# Altium schematic sheet sensors.SchDoc
size 381 x 355 mm; SheetNumber: 2; SheetTotal: 4
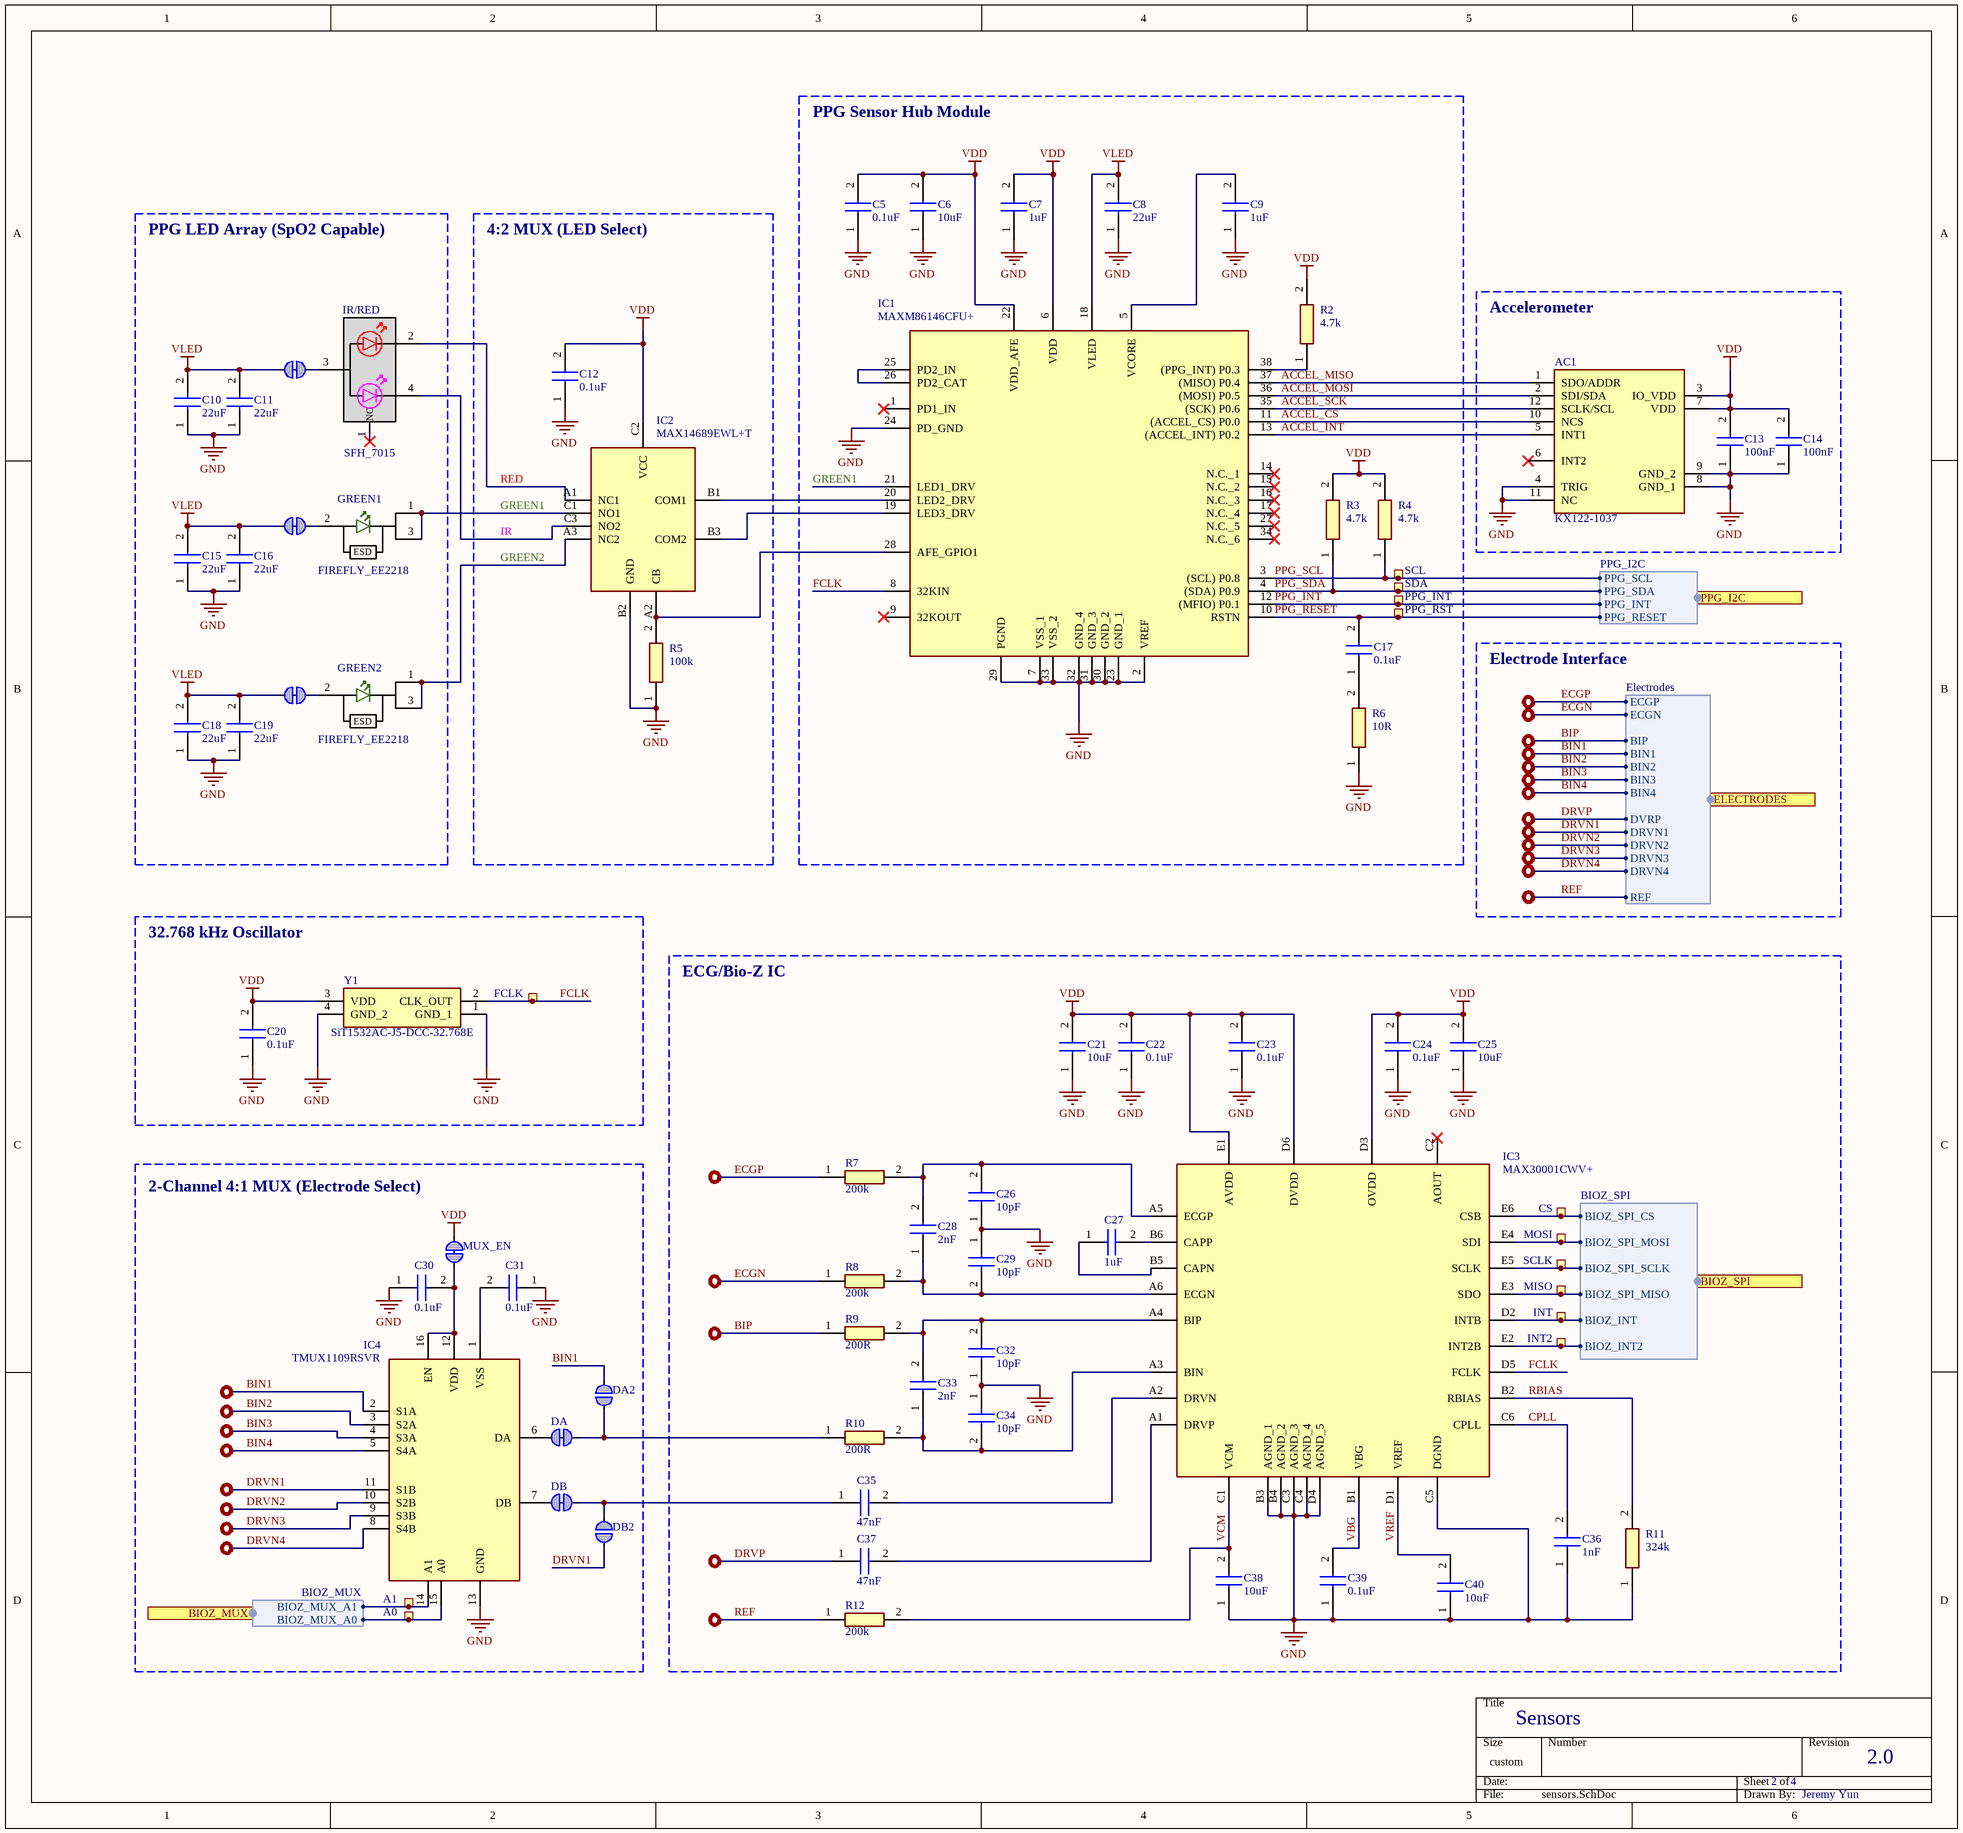
[diagram p0: sensors.SchDoc]

## Parts
A0  Ø1.0mm,SMD  [TP_SMD_D1.0mm]  (value not drawn)  (no BOM)
A1  Ø1.0mm,SMD  [TP_SMD_D1.0mm]  (value not drawn)  (no BOM)
AC1  KX122-1037  [KX1221037]
C5  0.1uF  [CAPC1005X55N]
C6  10uF  [CAPC1005X55N]
C7  1uF  [CAPC1005X55N]
C8  22uF  [CAPC1005X55N]
C9  1uF  [CAPC1005X55N]
C10  22uF  [CAPC1005X55N]
C11  22uF  [CAPC1005X55N]
C12  0.1uF  [CAPC1005X55N]
C13  100nF  [CAPC1005X55N]
C14  100nF  [CAPC1005X55N]
C15  22uF  [CAPC1005X55N]
C16  22uF  [CAPC1005X55N]
C17  0.1uF  [CAPC1005X55N]
C18  22uF  [CAPC1005X55N]
C19  22uF  [CAPC1005X55N]
C20  0.1uF  [CAPC1005X55N]
C21  10uF  [CAPC1005X55N]
C22  0.1uF  [CAPC1005X55N]
C23  0.1uF  [CAPC1005X55N]
C24  0.1uF  [CAPC1005X55N]
C25  10uF  [CAPC1005X55N]
C26  10pF  [CAPC0603X33N]
C27  1uF  [CAPC1005X55N]
C28  2nF  [C0603]
C29  10pF  [CAPC0603X33N]
C30  0.1uF  [CAPC1005X55N]
C31  0.1uF  [CAPC1005X55N]
C32  10pF  [CAPC0603X33N]
C33  2nF  [C0603]
C34  10pF  [CAPC0603X33N]
C35  47nF  [CAPC2012X140N]
C36  1nF  [C0402]
C37  47nF  [CAPC2012X140N]
C38  10uF  [CAPC1005X55N]
C39  0.1uF  [CAPC1005X55N]
C40  10uF  [CAPC1005X55N]
CS  Ø1.0mm,SMD  [TP_SMD_D1.0mm]  (value not drawn)  (no BOM)
DA  Solderbridge  [Solderbridge_Shorted]  (value not drawn)  (net tie, no BOM)
DA2  Solderbridge  [Solderbridge]  (value not drawn)  (no BOM)
DB  Solderbridge  [Solderbridge_Shorted]  (value not drawn)  (net tie, no BOM)
DB2  Solderbridge  [Solderbridge]  (value not drawn)  (no BOM)
FCLK  Ø1.0mm,SMD  [TP_SMD_D1.0mm]  (value not drawn)  (no BOM)
GR1  Solderbridge  [Solderbridge_Shorted]  (value not drawn)  (net tie, no BOM)
GR2  Solderbridge  [Solderbridge_Shorted]  (value not drawn)  (net tie, no BOM)
GREEN1  FIREFLY_EE2218  [CTDBLP31126C5D56J6U620R18]
GREEN2  FIREFLY_EE2218  [CTDBLP31126C5D56J6U620R18]
IC1  MAXM86146CFU+  [MAXM86146CFU]
IC2  MAX14689EWL+T  [BGA9C40P3X3_124X124X69]
IC3  MAX30001CWV+  [BGA30C50P6X5_293X274X69]
IC4  TMUX1109RSVR  [TMUX1109RSVR]
INT  Ø1.0mm,SMD  [TP_SMD_D1.0mm]  (value not drawn)  (no BOM)
INT2  Ø1.0mm,SMD  [TP_SMD_D1.0mm]  (value not drawn)  (no BOM)
IR/RED  SFH_7015  [SFH7015]
MISO  Ø1.0mm,SMD  [TP_SMD_D1.0mm]  (value not drawn)  (no BOM)
MOSI  Ø1.0mm,SMD  [TP_SMD_D1.0mm]  (value not drawn)  (no BOM)
MUX_EN  Solderbridge  [Solderbridge_Shorted]  (value not drawn)  (net tie, no BOM)
PPG_INT  Ø1.0mm,SMD  [TP_SMD_D1.0mm]  (value not drawn)  (no BOM)
PPG_RST  Ø1.0mm,SMD  [TP_SMD_D1.0mm]  (value not drawn)  (no BOM)
R2  4.7k  [RESC1005X40N]
R3  4.7k  [RESC1005X40N]
R4  4.7k  [RESC1005X40N]
R5  100k  [RESC1005X40N]
R6  10R  [RESC1005X40N]
R7  200k  [ERJ2RKD1004X]
R8  200k  [ERJ2RKD1004X]
R9  200R  [ERJ2RKD1004X]
R10  200R  [ERJ2RKD1004X]
R11  324k  [RESC1608X55N]
R12  200k  [ERJ2RKD1004X]
RED/IR  Solderbridge  [Solderbridge_Shorted]  (value not drawn)  (net tie, no BOM)
SCL  Ø1.0mm,SMD  [TP_SMD_D1.0mm]  (value not drawn)  (no BOM)
SCLK  Ø1.0mm,SMD  [TP_SMD_D1.0mm]  (value not drawn)  (no BOM)
SDA  Ø1.0mm,SMD  [TP_SMD_D1.0mm]  (value not drawn)  (no BOM)
Y1  SiT1532AC-J5-DCC-32.768E  [SiT1532ACJ5DCC32768E]

## Blocks framed on the sheet
PPG Sensor Hub Module: C5-C9 C17 IC1 PPG_INT PPG_RST R2-R4 R6 SCL SDA
PPG LED Array (SpO2 Capable): C10 C11 C15 C16 C18 C19 GR1 GR2 GREEN1 GREEN2 IR/RED RED/IR
4:2 MUX (LED Select): C12 IC2 R5
Accelerometer: AC1 C13 C14
32.768 kHz Oscillator: C20 FCLK Y1
ECG/Bio-Z IC: C21-C29 C32-C40 CS IC3 INT INT2 MISO MOSI R7-R12 SCLK
2-Channel 4:1 MUX (Electrode Select): A0 A1 C30 C31 DA DA2 DB DB2 IC4 MUX_EN

## Ports
BIOZ_MUX (harness BIOZ_MUX), BIOZ_SPI (harness BIOZ_SPI), ELECTRODES (harness Electrodes), PPG_I2C (harness PPG_I2C)

## Harnesses
Electrodes: ECGP, ECGN, BIN1, BIP, BIN2, BIN3, BIN4, DVRP, DRVN1, DRVN3, DRVN2, DRVN4, REF
BIOZ_SPI: BIOZ_SPI_CS, BIOZ_SPI_MOSI, BIOZ_SPI_MISO, BIOZ_SPI_SCLK, BIOZ_INT, BIOZ_INT2
PPG_I2C: PPG_SCL, PPG_SDA, PPG_INT, PPG_RESET
BIOZ_MUX: BIOZ_MUX_A0, BIOZ_MUX_A1

## Nets
GND: AC1.4(TRIG) AC1.8(GND_1) AC1.9(GND_2) AC1.11(NC) C5.1 C6.1 C7.1 C8.1 C9.1 C10.1 C11.1 C12.1 C13.1 C14.1 C15.1 C16.1 C18.1 C19.1 C20.1 C21.1 C22.1 C23.1 C24.1 C25.1 C26.1 C29.1 C30.1 C31.1 C32.1 C34.1 C36.1 C38.1 C39.1 C40.1 IC1.2(VREF) IC1.7(VSS_1) IC1.23(GND_1) IC1.24(PD_GND) IC1.29(PGND) IC1.30(GND_2) IC1.31(GND_3) IC1.32(GND_4) IC1.33(VSS_2) IC2.B2(GND) IC3.B3(AGND_1) IC3.B4(AGND_2) IC3.C3(AGND_3) IC3.C4(AGND_4) IC3.C5(DGND) IC3.D4(AGND_5) IC4.13(GND) R5.1 R6.1 R11.1 Y1.1(GND_1) Y1.4(GND_2)
VDD: AC1.3(IO_VDD) AC1.7(VDD) C5.2 C6.2 C7.2 C12.2 C13.2 C14.2 C20.2 C21.2 C22.2 C23.2 C24.2 C25.2 IC1.6(VDD) IC1.22(VDD_AFE) IC2.C2(VCC) IC3.D3(OVDD) IC3.D6(DVDD) IC3.E1(AVDD) MUX_EN.1 R2.2 R3.2 R4.2 Y1.3(VDD)
VLED: C8.2 C10.2 C11.2 C15.2 C16.2 C18.2 C19.2 GR1.1 GR2.1 IC1.18(VLED) RED/IR.1
ACCEL_CS: AC1.10(NCS) IC1.11((ACCEL_CS)_P0.0)
ACCEL_INT: AC1.5(INT1) IC1.13((ACCEL_INT)_P0.2)
ACCEL_MISO: AC1.1(SDO/ADDR) IC1.37((MISO)_P0.4)
ACCEL_MOSI: AC1.2(SDI/SDA) IC1.36((MOSI)_P0.5)
ACCEL_SCK: AC1.12(SCLK/SCL) IC1.35((SCK)_P0.6)
BIN1: DA2.1 IC4.2(S1A) ; port ELECTRODES.BIN1
BIN2: IC4.3(S2A) ; port ELECTRODES.BIN2
BIN3: IC4.4(S3A) ; port ELECTRODES.BIN3
BIN4: IC4.5(S4A) ; port ELECTRODES.BIN4
BIP: R9.1 ; port ELECTRODES.BIP
CPLL: C36.2 IC3.C6(CPLL)
DRVN1: DB2.2 IC4.11(S1B) ; port ELECTRODES.DRVN1
DRVN2: IC4.10(S2B) ; port ELECTRODES.DRVN2
DRVN3: IC4.9(S3B) ; port ELECTRODES.DRVN3
DRVN4: IC4.8(S4B) ; port ELECTRODES.DRVN4
DRVP: C37.1 ; port ELECTRODES.DVRP
ECGN: R8.1 ; port ELECTRODES.ECGN
ECGP: R7.1 ; port ELECTRODES.ECGP
FCLK: FCLK.1 IC1.8(32KIN) IC3.D5(FCLK) Y1.2(CLK_OUT)
GREEN1: GREEN1.1(K_1) GREEN1.3(K_2) IC1.21(LED1_DRV) IC2.C1(NO1)
GREEN2: GREEN2.1(K_1) GREEN2.3(K_2) IC2.A3(NC2)
IR: IC2.C3(NO2) IR/RED.4(CATHODE_EMITTER_2_(940_NM))
PPG_INT: IC1.12((MFIO)_P0.1) PPG_INT.1 ; port PPG_I2C.PPG_INT
PPG_RESET: C17.2 IC1.10(RSTN) PPG_RST.1 ; port PPG_I2C.PPG_RESET
PPG_SCL: IC1.3((SCL)_P0.8) R4.1 SCL.1 ; port PPG_I2C.PPG_SCL
PPG_SDA: IC1.4((SDA)_P0.9) R3.1 SDA.1 ; port PPG_I2C.PPG_SDA
RBIAS: IC3.B2(RBIAS) R11.2
RED: IC2.A1(NC1) IR/RED.2(CATHODE_EMITTER_1_(655_NM))
REF: R12.1 ; port ELECTRODES.REF
VBG: C39.2 IC3.B1(VBG)
VCM: C38.2 IC3.C1(VCM) R12.2
VREF: C40.2 IC3.D1(VREF)
NetA0_1: A0.1 IC4.15(A0) ; port BIOZ_MUX.BIOZ_MUX_A0
NetA1_1: A1.1 IC4.14(A1) ; port BIOZ_MUX.BIOZ_MUX_A1
NetC9_2: C9.2 IC1.5(VCORE)
NetC17_1: C17.1 R6.2
NetC26_2: C26.2 C28.2 IC3.A5(ECGP) R7.2
NetC27_1: C27.1 IC3.B5(CAPN)
NetC27_2: C27.2 IC3.B6(CAPP)
NetC28_1: C28.1 C29.2 IC3.A6(ECGN) R8.2
NetC30_2: C30.2 IC4.12(VDD) IC4.16(EN) MUX_EN.2
NetC31_2: C31.2 IC4.1(VSS)
NetC32_2: C32.2 C33.2 IC3.A4(BIP) R9.2
NetC33_1: C33.1 C34.2 IC3.A3(BIN) R10.2
NetC35_1: C35.1 DB.1 DB2.1
NetC35_2: C35.2 IC3.A2(DRVN)
NetC37_2: C37.2 IC3.A1(DRVP)
NetCS_1: CS.1 IC3.E6(CSB) ; port BIOZ_SPI.BIOZ_SPI_CS
NetDA_1: DA.1 DA2.2 R10.1
NetDA_2: DA.2 IC4.6(DA)
NetDB_2: DB.2 IC4.7(DB)
NetGR1_2: GR1.2 GREEN1.2(A)
NetGR2_2: GR2.2 GREEN2.2(A)
NetIC1_19: IC1.19(LED3_DRV) IC2.B3(COM2)
NetIC1_20: IC1.20(LED2_DRV) IC2.B1(COM1)
NetIC1_25: IC1.25(PD2_IN) IC1.26(PD2_CAT)
NetIC1_28: IC1.28(AFE_GPIO1) IC2.A2(CB) R5.2
NetIC1_38: IC1.38((PPG_INT)_P0.3) R2.1
NetIC3_D2: IC3.D2(INTB) INT.1 ; port BIOZ_SPI.BIOZ_INT
NetIC3_E2: IC3.E2(INT2B) INT2.1 ; port BIOZ_SPI.BIOZ_INT2
NetIC3_E3: IC3.E3(SDO) MISO.1 ; port BIOZ_SPI.BIOZ_SPI_MISO
NetIC3_E4: IC3.E4(SDI) MOSI.1 ; port BIOZ_SPI.BIOZ_SPI_MOSI
NetIC3_E5: IC3.E5(SCLK) SCLK.1 ; port BIOZ_SPI.BIOZ_SPI_SCLK
NetIR/RED_3: IR/RED.3(A) RED/IR.2

Not connected (* = marked no-connect by the designer): AC1 6(INT2)*; IC1 1(PD1_IN)* 9(32KOUT)* 14(N.C._1)* 15(N.C._2)* 16(N.C._3)* 17(N.C._4)* 27(N.C._5)* 34(N.C._6)*; IC3 C2(AOUT)*; IR/RED 1(NC)*

## Notes on the sheet
- Electrode Interface
- Sensors
- 2
- 4
- 2.0
- Jeremy Yun
- (in symbol CT_DBLP31.12-6C5D-56-J6U6-20-R18) ESD

## Library data of the parts
A0 A1 CS FCLK INT INT2 MISO MOSI PPG_INT PPG_RST SCL SCLK SDA = TP_SMD_Ø1.0MM: 1.0mm circular SMD testpad; Manufacturer: Nordic Semiconductor; Manufacturer Part Number: N.A.; Pad Count: 1; Part Number: TP_SMD_Ø1.0MM; LatestRevisionDate: 2021-03-05; Pin Count: 1; Publisher: Nordic Semiconductor; Published: 2013-06-11; Value: Ø1.0mm,SMD; Note: N.A.; Artikkelnr Noca: N.A.; Footprint Doc: TP_SMD_Ø1.0mm; Part number IPS: N.A.; ComponentLink1URL: N.A.; ComponentLink1Description: Datasheet; ComponentLink2URL: N.A.; ComponentLink2Description: Supplier link; HelpURL: N.A.; Supplier 1: N.A.; Supplier Part Number 1: N.A.; Supplier 2: N.A.; Supplier Part Number 2: N.A.; Author: rsk; Component Class: Connectors; PartId: 100500475; Part number Norautron: N.A.
AC1 = KX122-1037: Accelerometer; Manufacturer_Name: Kionix; Datasheet Link: https://kionixfs.azureedge.net/en/document/TN008-PCB-Design-Guidelines-for-2x2-LGA-Sensors.pdf; Height: 1mm; Manufacturer_Part_Number: KX122-1037; Mouser Part Number: 912-KX122-1037; Mouser Price/Stock: https://www.mouser.co.uk/ProductDetail/Kionix/KX122-1037?qs=6OIXIgk3fwdhApAbA9esZQ%3D%3D
C5 C12 C17 C20 C22-C24 C30 C31 C39 = GRM155R71C104KA88D: Capacitor; Manufacturer_Name: Murata Electronics; Datasheet Link: http://www.murata.com/~/media/webrenewal/support/library/catalog/products/capacitor/mlcc/c02e.pdf; Height: 0.55mm; Manufacturer_Part_Number: GRM155R71C104KA88D; Mouser Part Number: N/A; Arrow Part Number: GRM155R71C104KA88D; Arrow Price/Stock: https://www.arrow.com/en/products/grm155r71c104ka88d/murata-manufacturing?region=nac
C6 C21 C25 C38 C40 = GRM155R60J106ME05D: Capacitor 10uF X5R Ceramic; Manufacturer_Name: Murata Electronics; Datasheet Link: http://www.murata.com/~/media/webrenewal/support/library/catalog/products/capacitor/mlcc/c02e.pdf; Height: 0.55mm; Manufacturer_Part_Number: GRM155R60J106ME05D; Mouser Part Number: 81-GRM155R60J106M05D; Mouser Price/Stock: https://www.mouser.co.uk/ProductDetail/Murata-Electronics/GRM155R60J106ME05D?qs=d0WKAl%252BL4KYEzZPQ8Lkwdw%3D%3D; Arrow Part Number: GRM155R60J106ME05D; Arrow Price/Stock: https://www.arrow.com/en/products/grm155r60j106me05d/murata-manufacturing?region=nac
C7 C9 C27 = CL05B104KP5NNNC: Capacitor; Manufacturer_Name: SAMSUNG; Datasheet Link: http://product.samsungsem.com/mlcc/CL05B104KP5NNN.do; Height: 0.55mm; Manufacturer_Part_Number: CL05B104KP5NNNC; Mouser Part Number: 187-CL05B104KP5NNNC; Mouser Price/Stock: https://www.mouser.co.uk/ProductDetail/Samsung-Electro-Mechanics/CL05B104KP5NNNC?qs=349EhDEZ59qDkVTTBSSSxw%3D%3D; Arrow Part Number: CL05B104KP5NNNC; Arrow Price/Stock: https://www.arrow.com/en/products/cl05b104kp5nnnc/samsung-electro-mechanics?region=nac
C8 C10 C11 C15 C16 C18 C19 = CL05B224KO5NNNC: Capacitor; Manufacturer_Name: SAMSUNG; Datasheet Link: https://media.digikey.com/pdf/Data%20Sheets/Samsung%20PDFs/CL05B224KO5NNNC_Spec.pdf; Height: 0.55mm; Manufacturer_Part_Number: CL05B224KO5NNNC; Mouser Part Number: 187-CL05B224KO5NNNC; Mouser Price/Stock: https://www.mouser.co.uk/ProductDetail/Samsung-Electro-Mechanics/CL05B224KO5NNNC?qs=X6jEic%2FHinCN6V6mK7LtLg%3D%3D; Arrow Part Number: CL05B224KO5NNNC; Arrow Price/Stock: https://www.arrow.com/en/products/cl05b224ko5nnnc/samsung-electro-mechanics
C13 C14 = CL05B104KP5VPNC: Capacitor; Manufacturer_Name: SAMSUNG; Datasheet Link: https://product.samsungsem.com/mlcc/CL05B104KP5VPN.do; Height: 0.55mm; Manufacturer_Part_Number: CL05B104KP5VPNC; Mouser Part Number: 187-CL05B104KP5VPNC; Mouser Price/Stock: https://www.mouser.co.uk/ProductDetail/Samsung-Electro-Mechanics/CL05B104KP5VPNC?qs=gqBM4hNBiUXTv%252BkFO9q2pQ%3D%3D
C26 C29 C32 C34 = GRM0335C1E100JA01D: Capacitor; Manufacturer_Name: Murata Electronics; Datasheet Link: http://www.murata.com/~/media/webrenewal/support/library/catalog/products/capacitor/mlcc/c02e.pdf; Height: 0.33mm; Manufacturer_Part_Number: GRM0335C1E100JA01D; Mouser Part Number: 81-GRM0335C1E100JA1D; Mouser Price/Stock: https://www.mouser.co.uk/ProductDetail/Murata-Electronics/GRM0335C1E100JA01D?qs=3ZwS9AhGA%2F61ULaWXbLsuw%3D%3D; Arrow Part Number: GRM0335C1E100JA01D; Arrow Price/Stock: https://www.arrow.com/en/products/grm0335c1e100ja01d/murata-manufacturing?region=nac
C28 C33 = C0603C202G4HACAUTO: Capacitor; Manufacturer_Name: KEMET; Datasheet Link: https://content.kemet.com/datasheets/KEM_C1007_X8R_ULTRA_150C_SMD.pdf; Height: 0.87mm; Manufacturer_Part_Number: C0603C202G4HACAUTO
C35 C37 = C0805C473K1RECAUTO7210: Capacitor; Manufacturer_Name: KEMET; Datasheet Link: https://connect.kemet.com:7667/gateway/IntelliData-ComponentDocumentation/1.0/download/specsheet/C0805C473K1RECAUTO7210; Height: 1.4mm; Manufacturer_Part_Number: C0805C473K1RECAUTO7210; Mouser Part Number: 80-C0805C473K1REAULR; Mouser Price/Stock: https://www.mouser.com/Search/Refine.aspx?Keyword=80-C0805C473K1REAULR
C36 = C0402C102J1GEC7411: Capacitor; Manufacturer_Name: KEMET; Datasheet Link: https://content.kemet.com/datasheets/KEM_C1091_C0G_ESD.pdf; Height: 0.55mm; Manufacturer_Part_Number: C0402C102J1GEC7411; Mouser Part Number: 80-C0402C102J1GECLR; Mouser Price/Stock: https://www.mouser.co.uk/ProductDetail/KEMET/C0402C102J1GEC7411?qs=55YtniHzbhDbMp4X17Pi5A%3D%3D
DA DB GR1 GR2 MUX_EN RED/IR = Solderbridge Shorted: Shorted Solderbridge; Manufacturer: N.A.; Pad Count: 2; Part Number: Solderbridge Shorted; Manufacturer Part Number: N.A.; LatestRevisionDate: 2012-08-07; Pin Count: 2; Publisher: Nordic Semiconductor; Published: 2012-08-07; Value: Solderbridge; Note: N.A.; Artikkelnr Noca: N.A.; Footprint Doc: Solderbridge_Shorted; Part number IPS: N.A.; ComponentLink1URL: N.A.; ComponentLink1Description: Datasheet; ComponentLink2URL: N.A.; ComponentLink2Description: Supplier link; HelpURL: N.A.; Supplier 1: N.A.; Supplier Part Number 1: N.A.; Supplier 2: N.A.; Supplier Part Number 2: N.A.; Author: rsk; Component Class: Connectors; PartId: 100500459; Part number Norautron: N.A.
DA2 DB2 = Solderbridge: Manufacturer: N.A.; Pad Count: 2; Part Number: Solderbridge; Manufacturer Part Number: N.A.; LatestRevisionDate: 2009-12-14; Pin Count: 2; Publisher: Nordic Semiconductor; Published: 2009-12-14; Value: Solderbridge; Note: N.A.; Artikkelnr Noca: N.A.; Footprint Doc: Solderbridge; Part number IPS: N.A.; ComponentLink1URL: N.A.; ComponentLink1Description: Datasheet; ComponentLink2URL: N.A.; ComponentLink2Description: Supplier link; HelpURL: N.A.; Supplier 1: N.A.; Supplier Part Number 1: N.A.; Supplier 2: N.A.; Supplier Part Number 2: N.A.; Author: rsk; Component Class: Connectors; PartId: 100500458; Part number Norautron: N.A.
GREEN1 GREEN2 = CT_DBLP31.12-6C5D-56-J6U6-20-R18: LED; Manufacturer_Name: ams OSRAM; Manufacturer_Part_Number: CT DBLP31.12-6C5D-56-J6U6-20-R18; Datasheet Link: https://www.mouser.com/catalog/specsheets/Osram-03-25-2019-CT%20DBLP31.12_EN.pdf; Mouser Part Number: 720-CTDBLP31A6091; Mouser Price/Stock: https://www.mouser.co.uk/ProductDetail/OSRAM-Opto-Semiconductors/CT-DBLP3112-6C5D-56-J6U6-20-R18?qs=vLWxofP3U2xgbqKYEOstuw%3D%3D
IC1 = MAXM86146CFU+: Integrated Circuit; Manufacturer_Name: Analog Devices; Datasheet Link: https://datasheets.maximintegrated.com/en/ds/MAXM86146.pdf; Height: 0.975mm; Manufacturer_Part_Number: MAXM86146CFU+; Mouser Part Number: 700-MAXM86146CFU+; Mouser Price/Stock: https://www.mouser.co.uk/ProductDetail/Analog-Devices-Maxim-Integrated/MAXM86146CFU%2b?qs=7MVldsJ5UaxGg5O5mFC%252Bgg%3D%3D
IC2 = MAX14689EWL+T: Integrated Circuit; Manufacturer_Name: Analog Devices; Datasheet Link: https://datasheets.maximintegrated.com/en/ds/MAX14689.pdf; Height: 0.69mm; Manufacturer_Part_Number: MAX14689EWL+T; Mouser Part Number: 700-MAX14689EWL+T; Mouser Price/Stock: https://www.mouser.co.uk/ProductDetail/Maxim-Integrated/MAX14689EWL%2bT?qs=jKHy77vQLH2WsIix%2FYfctQ%3D%3D
IC3 = MAX30001CWV+: Integrated Circuit; Manufacturer_Name: Analog Devices; Datasheet Link: https://datasheets.maximintegrated.com/en/ds/MAX30001.pdf; Height: 0.69mm; Manufacturer_Part_Number: MAX30001CWV+; Mouser Part Number: 700-MAX30001CWV+; Mouser Price/Stock: https://www.mouser.co.uk/ProductDetail/Analog-Devices-Maxim-Integrated/MAX30001CWV%2b?qs=gt1LBUVyoHlQ9wjGIPyD2Q%3D%3D
IC4 = TMUX1109RSVR: Integrated Circuit; Manufacturer_Name: Texas Components; Datasheet Link: https://www.ti.com/lit/ds/symlink/tmux1109.pdf?ts=1635353641443&ref_url=https%253A%252F%252Fwww.ti.com%252Fswitches-multiplexers%252Fanalog%252Fproducts.html; Height: 0.55mm; Manufacturer_Part_Number: TMUX1109RSVR
IR/RED = SFH_7015: LED; Manufacturer_Name: ams OSRAM; Datasheet Link: https://www.osram.com/ecat/CHIPLED%C2%AE%20SFH%207015/com/en/class_pim_web_catalog_103489/global/prd_pim_device_6573079/; Height: 0.7mm; Manufacturer_Part_Number: SFH 7015; Mouser Part Number: 720-SFH7015; Mouser Price/Stock: https://www.mouser.co.uk/ProductDetail/OSRAM-Opto-Semiconductors/SFH-7015?qs=OTrKUuiFdkbk%2F%252BQNXT%2FkUA%3D%3D; Arrow Part Number: SFH 7015; Arrow Price/Stock: https://www.arrow.com/en/products/sfh-7015/osram-opto-semiconductors?region=nac
R2-R4 = RC0402FR-074K7L: Resistor; Manufacturer_Name: KEMET; Datasheet Link: http://www.yageo.com/documents/recent/PYu-RC0402_51_RoHS_L_6_r.pdf; Height: 0.4mm; Manufacturer_Part_Number: RC0402FR-074K7L; Mouser Part Number: 603-RC0402FR-074K7L; Mouser Price/Stock: https://www.mouser.co.uk/ProductDetail/YAGEO/RC0402FR-074K7L?qs=V1yeUXFNrkn%2FmCXC8N8TTA%3D%3D; Arrow Part Number: RC0402FR-074K7L; Arrow Price/Stock: https://www.arrow.com/en/products/rc0402fr-074k7l/yageo
R5 = RC0402FR-07100KL: Resistor; Manufacturer_Name: YAGEO; Datasheet Link: https://componentsearchengine.com/Datasheets/2/RC0402FR-07100KL.pdf; Height: 0.4mm; Manufacturer_Part_Number: RC0402FR-07100KL; Mouser Part Number: 603-RC0402FR-07100KL; Mouser Price/Stock: https://www.mouser.co.uk/ProductDetail/YAGEO/RC0402FR-07100KL?qs=mnq%2FyloZIXzTlUn7JAHSWg%3D%3D; Arrow Part Number: RC0402FR-07100KL; Arrow Price/Stock: https://www.arrow.com/en/products/rc0402fr-07100kl/yageo?region=europe
R6 = RC0402FR-0710RL: Resistor; Manufacturer_Name: KEMET; Datasheet Link: http://www.yageo.com/documents/recent/PYu-RC0402_51_RoHS_L_6_r.pdf; Height: 0.4mm; Manufacturer_Part_Number: RC0402FR-0710RL; Mouser Part Number: 603-RC0402FR-0710RL; Mouser Price/Stock: https://www.mouser.co.uk/ProductDetail/YAGEO/RC0402FR-0710RL?qs=V1yeUXFNrkkzkWCUUWS9og%3D%3D
R7 R8 R12 = ERJ-2RKF2003X: Resistor; Manufacturer_Name: Panasonic; Datasheet Link: https://industrial.panasonic.com/cdbs/www-data/pdf/RDA0000/AOA0000C86.pdf; Height: 0.4mm; Manufacturer_Part_Number: ERJ-2RKF2003X; Mouser Part Number: 667-ERJ-2RKF2003X; Mouser Price/Stock: https://www.mouser.co.uk/ProductDetail/Panasonic/ERJ-2RKF2003X?qs=H7k1u0Mp9JQs7qWHNZeKxQ%3D%3D; Arrow Part Number: ERJ-2RKF2003X; Arrow Price/Stock: https://www.arrow.com/en/products/erj2rkf2003x/panasonic?region=europe
R9 R10 = ERJ-2RKF2000X: Resistor; Manufacturer_Name: Panasonic; Datasheet Link: https://industrial.panasonic.com/cdbs/www-data/pdf/RDA0000/AOA0000C86.pdf; Height: 0.4mm; Manufacturer_Part_Number: ERJ-2RKF2000X; Mouser Part Number: 667-ERJ-2RKF2000X; Mouser Price/Stock: https://www.mouser.co.uk/ProductDetail/Panasonic/ERJ-2RKF2000X?qs=P9MxuNjgFLMhlpyylwMTwg%3D%3D; Arrow Part Number: ERJ-2RKF2000X; Arrow Price/Stock: https://www.arrow.com/en/products/erj-2rkf2000x/panasonic?region=nac
R11 = RN73C1J324KBTDF: Resistor; Manufacturer_Name: TE Connectivity; Datasheet Link: https://componentsearchengine.com/Datasheets/2/RN73C1J324KBTDF.pdf; Height: 0.55mm; Manufacturer_Part_Number: RN73C1J324KBTDF; Mouser Part Number: 279-RN73C1J324KBTDF; Mouser Price/Stock: https://www.mouser.co.uk/ProductDetail/TE-Connectivity-Holsworthy/RN73C1J324KBTDF?qs=8G8kQhBkhGjA96pes7zqwA%3D%3D
Y1 = SiT1532AC-J5-DCC-32.768E: Crystal or Oscillator; Manufacturer_Name: SiTime; Datasheet Link: https://www.sitime.com/support/resource-library/datasheets/sit1532-datasheet; Height: 0.6mm; Manufacturer_Part_Number: SiT1532AC-J5-DCC-32.768E; Mouser Part Number: 788-1532ACJ5DCC32.7E; Mouser Price/Stock: https://www.mouser.co.uk/ProductDetail/SiTime/SiT1532AC-J5-DCC-32768E?qs=dMZC7um9hO%252BBGGNkRGdGlw%3D%3D; Arrow Part Number: SIT1532AC-J5-DCC-32.768E; Arrow Price/Stock: https://www.arrow.com/en/products/sit1532ac-j5-dcc-32.768e/sitime?region=nac